# Altium schematic sheet TP_IHM_7SEG_DRIVERS.SchDoc
size A4
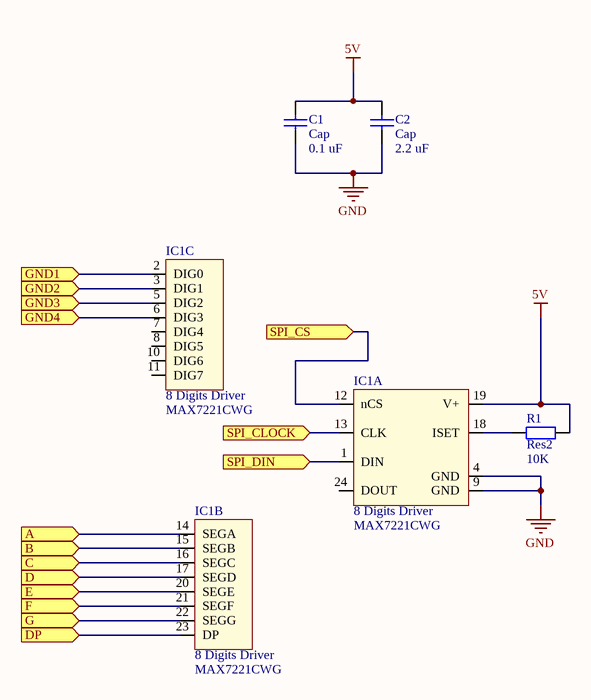
[diagram p0: TP_IHM_7SEG_DRIVERS.SchDoc]

## Parts
C1  Cap  value 0.1 uF  [RAD-0.3]
C2  Cap  value 2.2 uF  [RAD-0.3]
IC1  8 Digits Driver  [MAX7221CWG]  (parts A,B,C of 3)
R1  Res2  value 10K  [AXIAL-0.4]

## Ports
A, B, C, D, DP, E, F, G, GND1, GND2, GND3, GND4, SPI_CLOCK, SPI_CS, SPI_DIN

## Nets
5V: C1.2 C2.2 IC1.19(V+) R1.1
GND: C1.1 C2.1 IC1.4(GND) IC1.9(GND)
A: IC1.14(SEGA) ; port A
B: IC1.15(SEGB) ; port B
C: IC1.16(SEGC) ; port C
D: IC1.17(SEGD) ; port D
DP: IC1.23(DP) ; port DP
E: IC1.20(SEGE) ; port E
F: IC1.21(SEGF) ; port F
G: IC1.22(SEGG) ; port G
GND1: IC1.2(DIG0) ; port GND1
GND2: IC1.3(DIG1) ; port GND2
GND3: IC1.5(DIG2) ; port GND3
GND4: IC1.6(DIG3) ; port GND4
SPI_CLOCK: IC1.13(CLK) ; port SPI_CLOCK
SPI_CS: IC1.12(nCS) ; port SPI_CS
SPI_DIN: IC1.1(DIN) ; port SPI_DIN
NetIC1_18: IC1.18(ISET) R1.2

Not connected (* = marked no-connect by the designer): IC1 7(DIG4) 8(DIG5) 10(DIG6) 11(DIG7) 24(DOUT)

## Library data of the parts
C1 C2 = Cap: Capacitor; Published: 8-Jun-2000; LatestRevisionDate: 17-Jul-2002; LatestRevisionNote: Re-released for DXP Platform.; PackageReference: RAD-0.3; Publisher: Altium Limited; PackageDescription: Radial Cap, Thru-Hole; 2 Leads; 0.3 in Pin Spacing
IC1 = MAX7221: MAX7221 8 Digit 7 Segments Display; Reference: MAX7221CWG
R1 = Res2: Resistor; Published: 8-Jun-2000; LatestRevisionDate: 17-Jul-2002; LatestRevisionNote: Re-released for DXP Platform.; PackageReference: AXIAL-0.4; Publisher: Altium Limited; PackageDescription: Axial Device, Thru-Hole; 2 Leads; 0.4 in Pin Spacing